# EAGLE design RFID_Breakout (EAGLE 6.5.0)
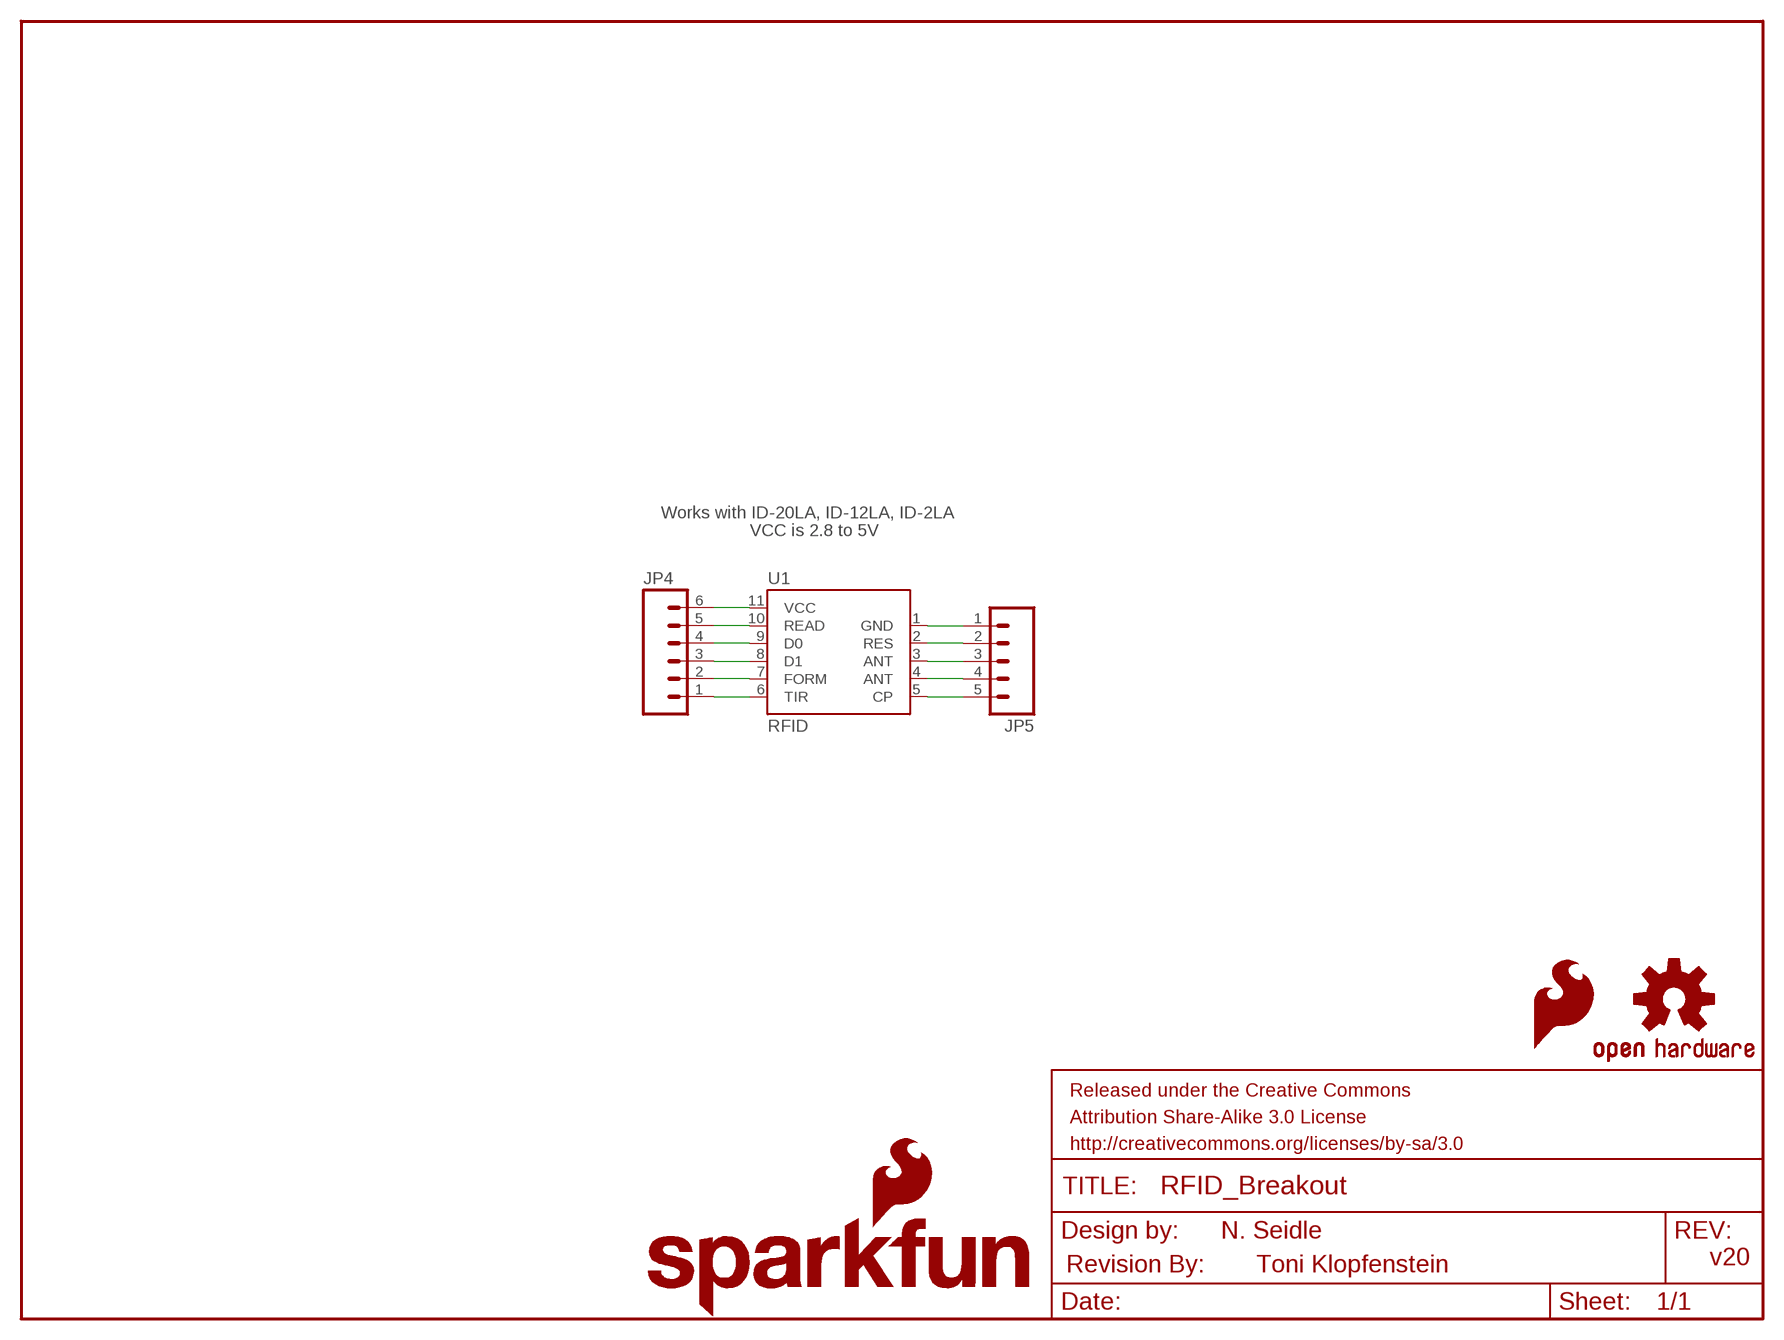
[diagram p0: schematic, sheet 1]

## Parts
FRAME1  FRAME-LETTER  [CREATIVE_COMMONS]
JP4  M06SIP  [1X06]
JP5  M05PTH  [1X05]
LOGO1  SFE_LOGO_FLAME.1_INCH  [SFE_LOGO_FLAME_.1]
LOGO2  SFE_LOGO_NAME_FLAME.1_INCH  [SFE_LOGO_NAME_FLAME_.1]
LOGO3  OSHW-LOGOS  [OSHW-LOGO-S]
U1  RFID  RFIDALL  [ID_PACKAGE]
U$1  REVISION  [REVISION]

## Nets
ANT1: JP5.3 U1.3(ANT)
ANT2: JP5.4 U1.4(ANT)
CP: JP5.5 U1.5(CP)
D0: JP4.4 U1.9(D0)
D1: JP4.3 U1.8(D1)
FORM: JP4.2 U1.7(FORM)
N$2: JP4.6 U1.11(VCC)
N$3: JP5.1 U1.1(GND)
READ: JP4.5 U1.10(READ)
RES: JP5.2 U1.2(RES)
TIR: JP4.1 U1.6(TIR)

## Notes on the sheet
- Works with ID-20LA, ID-12LA, ID-2LA
- VCC is 2.8 to 5V
- N. Seidle
- v20
- Toni Klopfenstein

## Library data of the parts
FRAME1 = SparkFun-Aesthetics:FRAME-LETTER: Schematic Frame Standard 8.5x11 US Letter frame
JP4 = SparkFun-Connectors:M06: Header 6 Standard 6-pin 0.1" header. Use with straight break away headers (SKU : PRT-00116), right angle break away headers (PRT-00553), swiss pins (PRT-00743), machine pins (PRT-00117), and female headers (PRT-00115). Molex polarized connector foot print use with SKU : PRT-08094 with associated crimp pins and housings. NOTES ON THE VARIANTS LOCK and LOCK_LONGPADS... This footprint was designed to help hold the alignment of a through-hole component (i.e. 6-pin header) while soldering it into place. You may notice that each hole has been shifted either up or down by 0.005 of an inch from it's more standard position (which is a perfectly straight line). This slight alteration caused the pins (the squares in the middle) to touch the edges of the holes. Because they are alternating, it causes a "brace" to hold the component in place. 0.005 has proven to be the perfect amount of "off-center" position when using our standard breakaway headers. Although looks a little odd when you look at the bare footprint, once you have a header in there, the alteration is very hard to notice. Also,if you push a header all the way into place, it is covered up entirely on the bottom side. This idea of altering the position of holes to aid alignment will be further integrated into the Sparkfun Library for other footprints. It can help hold any component with 3 or more connection pins.
JP5 = SparkFun-Connectors:M05: Header 5 Standard 5-pin 0.1" header. Use with straight break away headers (SKU : PRT-00116), right angle break away headers (PRT-00553), swiss pins (PRT-00743), machine pins (PRT-00117), and female headers (PRT-00115). Molex polarized connector foot print use with SKU : PRT-08230 with associated crimp pins and housings.
LOGO1 = SparkFun-Aesthetics:SFE_LOGO_FLAME: SFE Logo, flame only This is the SparkFun flame logo. The logo on the schematic will always be the same size; the package variant is the height of the flame. Default layer for the logo on the board is tSilk.
LOGO2 = SparkFun-Aesthetics:SFE_LOGO_NAME_FLAME: SFE Logo, name and flame This is the SparkFun full logo. The logo on the schematic will always be the same size; the package variant is the height of the flame part of the logo. Default layer for the logo on the board is tSilk.
LOGO3 = SparkFun-Aesthetics:OSHW-LOGO: Open Source Hardware Logo This logo indicates the piece of hardware it is found on incorporates a OSHW license and/or adheres to the definition of open source hardware found here: http://freedomdefined.org/OSHW
U1 = ID Innovations:RFID
U$1 = SparkFun-Aesthetics:REVISION

## Board
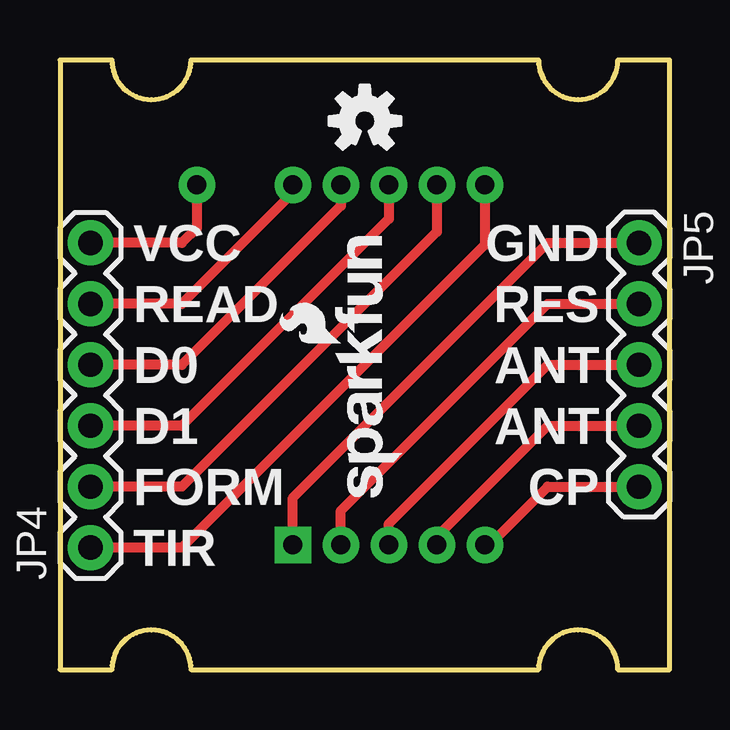
[diagram p1: board, top side]
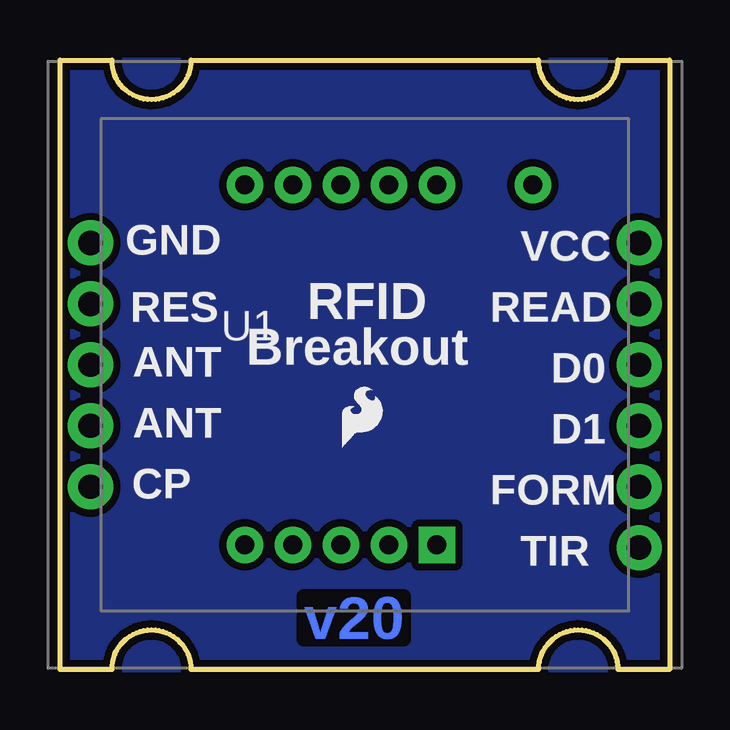
[diagram p2: board, bottom side, seen from below]

Size 25.4 x 25.4 mm. Coordinates in mm from the lower left corner, seen from the top.
Outline: 0,0 2.16,0 arc-180 5.46,0 19.94,0 arc-180 23.24,0 25.4,0 25.4,25.4 23.24,25.4 arc-180 19.94,25.4 5.46,25.4 arc-180 2.16,25.4 0,25.4 0,0
Copper layers (1*16): Top 0.035mm / dielectric 1.5mm / Bottom 0.035mm
Design rules "SparkFun-2-layer": minimum track width 7mil, minimum drill 15mil, track to track 8mil, track to pad 8mil, pad to pad 8mil, via to via 8mil, smd to smd 8mil, copper to edge 8mil, drill to drill 8mil, minimum pad ring 12mil, minimum via ring 10mil, stop-mask expansion 4mil, vias tented up to drill 20mil, thermal gap 10mil

### Footprints (pad centres in the part's own frame; a part is rotated, then mirrored left to right if it is on the bottom)
1X06 = drill 1.016 pad 1.88: 1 0,0; 2 2.54,0; 3 5.08,0; 4 7.62,0; 5 10.16,0; 6 12.7,0
1X05 = drill 1.016 pad 1.88: 1 0,0; 2 2.54,0; 3 5.08,0; 4 7.62,0; 5 10.16,0
ID_PACKAGE = drill 0.8 pad 1.524 square: 1 3,-7.5 | drill 0.8 pad 1.524: 2 1,-7.5; 3 -1,-7.5; 4 -3,-7.5; 5 -5,-7.5; 6 -5,7.5; 7 -3,7.5; 8 -1,7.5; 9 1,7.5; 10 3,7.5; 11 7,7.5

### Placement (x,y rotation side)
FRAME1  -24.13,-17.78 0 top  (outside the outline)
JP4  1.27,5.08 90 top
JP5  24.13,17.78 270 top
LOGO1  13.97,8.89 0 bottom
LOGO2  14.35,6.73 90 top
LOGO3  12.7,22.86 0 top
U1  12.7,12.7 0 bottom
U$1  -12.7,-20.32 0 top  (outside the outline)

### Tracks (layer width: path | path; a pad name or v marks a point on that pad's centre or on a via)
ANT1
  Top 0.406: U1.3 13.7,6.08 20.32,12.7 JP5.3
ANT2
  Top 0.406: U1.4 15.7,5.54 20.32,10.16 JP5.4
CP
  Top 0.406: U1.5 17.9,5.2 20.32,7.62 JP5.5
D0
  Top 0.406: U1.9 11.7,19.32 5.08,12.7 JP4.4
D1
  Top 0.406: U1.8 13.7,18.78 5.08,10.16 JP4.3
FORM
  Top 0.406: U1.7 15.7,18.24 5.08,7.62 JP4.2
N$1
  pour Bottom (isolate 0.305): 0,25.4 0,0 25.4,0 25.4,25.4
N$2
  Top 0.406: U1.11 5.7,18.4 5.08,17.78 JP4.6
N$3
  Top 0.406: U1.1 9.7,7.16 20.32,17.78 JP5.1
READ
  Top 0.406: U1.10 9.7,19.86 5.08,15.24 JP4.5
RES
  Top 0.406: U1.2 11.7,6.62 20.32,15.24 JP5.2
TIR
  Top 0.406: U1.6 17.7,17.7 5.08,5.08 JP4.1

### Text on the board
Bottom: v20
tPlace: GND | VCC | RES | READ | ANT | D0 | ANT | D1 | CP | FORM | TIR
bPlace: GND | VCC | RES | READ | RFID | ANT | Breakout | D0 | ANT | D1 | CP | FORM | TIR
tDocu: N. Seidle | Toni Klopfenstein